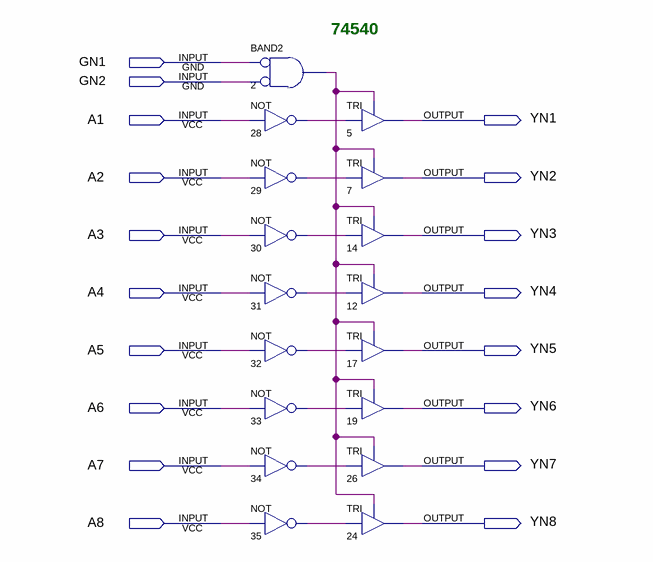
[diagram p0: schematic sheet]
// Quartus schematic 74540.bdf as structural Verilog: 17 symbols, 18 pins
module \74540  (
  input  GN1,
  input  GN2,
  input  A1,
  input  A2,
  input  A3,
  input  A4,
  input  A5,
  input  A6,
  input  A7,
  input  A8,
  output YN1,
  output YN2,
  output YN3,
  output YN4,
  output YN5,
  output YN6,
  output YN7,
  output YN8
);

  wire n2_out, n28_out, n29_out, n30_out, n31_out, n32_out, n33_out, n34_out, n35_out;

  and u_2 (n2_out, ~GN1, ~GN2);  // BAND2
  not u_28 (n28_out, A1);
  not u_29 (n29_out, A2);
  not u_30 (n30_out, A3);
  not u_31 (n31_out, A4);
  not u_32 (n32_out, A5);
  not u_33 (n33_out, A6);
  not u_34 (n34_out, A7);
  not u_35 (n35_out, A8);
  TRI u_5 (.IN(n28_out), .OE(n2_out), .OUT(YN1));
  TRI u_7 (.IN(n29_out), .OE(n2_out), .OUT(YN2));
  TRI u_14 (.IN(n30_out), .OE(n2_out), .OUT(YN3));
  TRI u_12 (.IN(n31_out), .OE(n2_out), .OUT(YN4));
  TRI u_17 (.IN(n32_out), .OE(n2_out), .OUT(YN5));
  TRI u_19 (.IN(n33_out), .OE(n2_out), .OUT(YN6));
  TRI u_26 (.IN(n34_out), .OE(n2_out), .OUT(YN7));
  TRI u_24 (.IN(n35_out), .OE(n2_out), .OUT(YN8));

  // Notes on the sheet:
  //   74540
endmodule
